# Altium schematic sheet robotShield.SchDoc
size A4; SheetNumber: 1; SheetTotal: 5
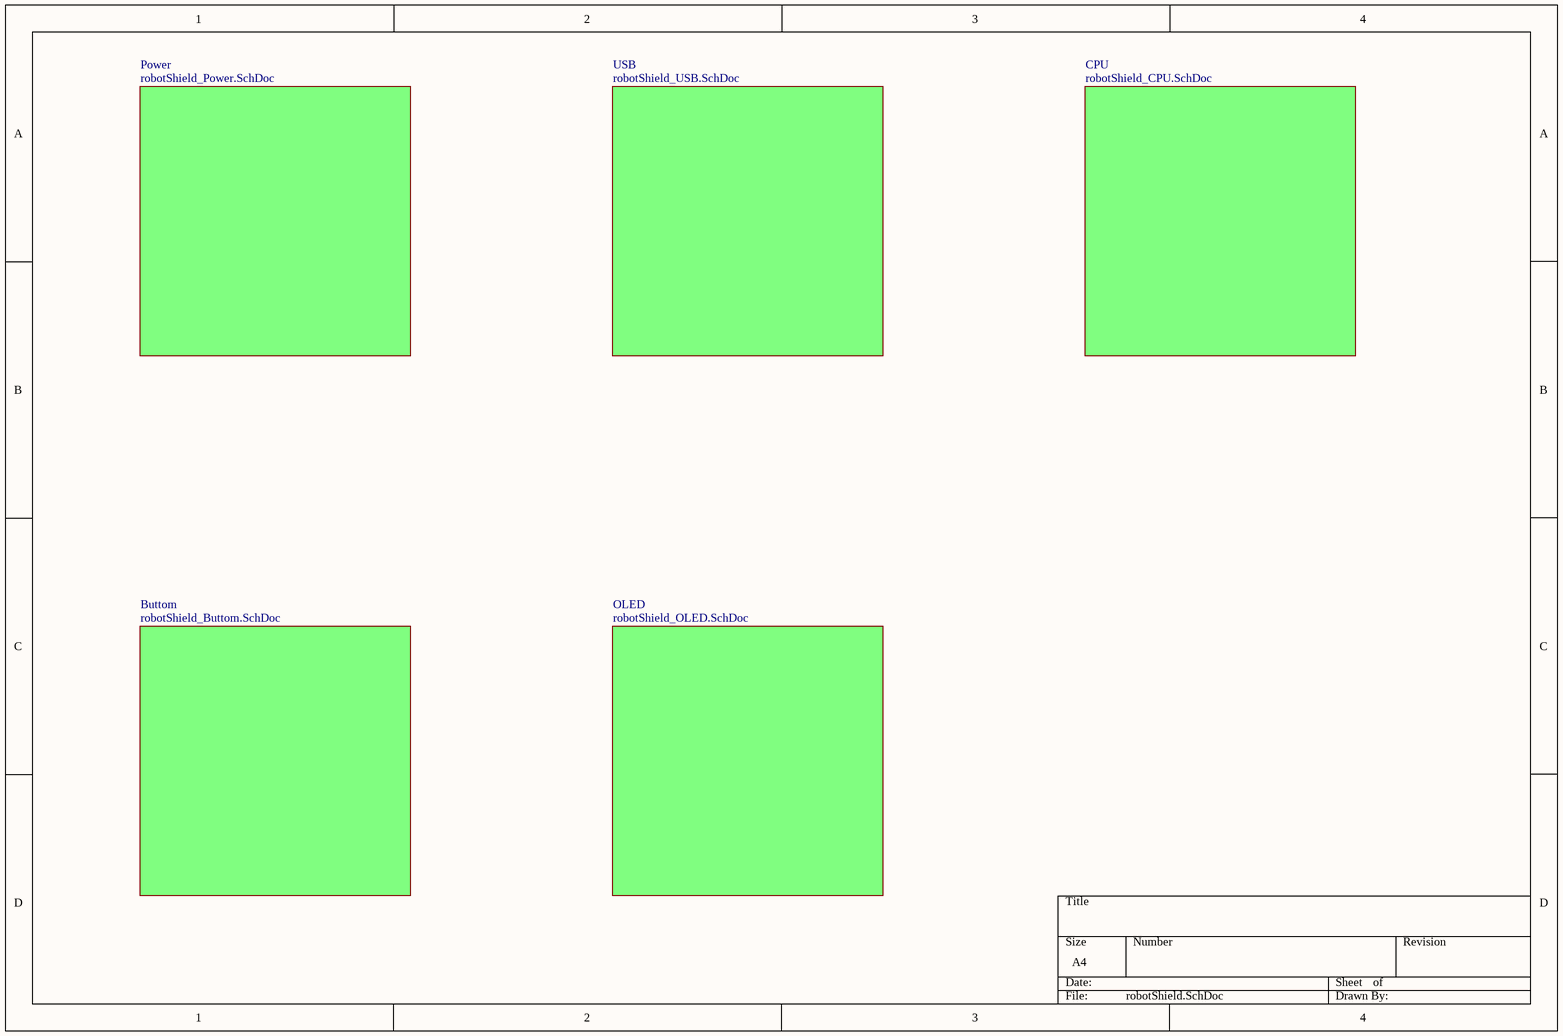
[diagram p0: robotShield.SchDoc]

## Sub-sheets
Buttom = robotShield_Buttom.SchDoc: no entries
CPU = robotShield_CPU.SchDoc: no entries
OLED = robotShield_OLED.SchDoc: no entries
Power = robotShield_Power.SchDoc: no entries
USB = robotShield_USB.SchDoc: no entries